# Altium schematic sheet TKeyboard.schDoc
size B; Organization: Altium Limited; Address1: L3, 12a Rodborough Rd; Address2: Frenchs Forest; Address3: NSW; Address4: Australia 2086; DocumentNumber: 1; SheetNumber: 1; SheetTotal: 1
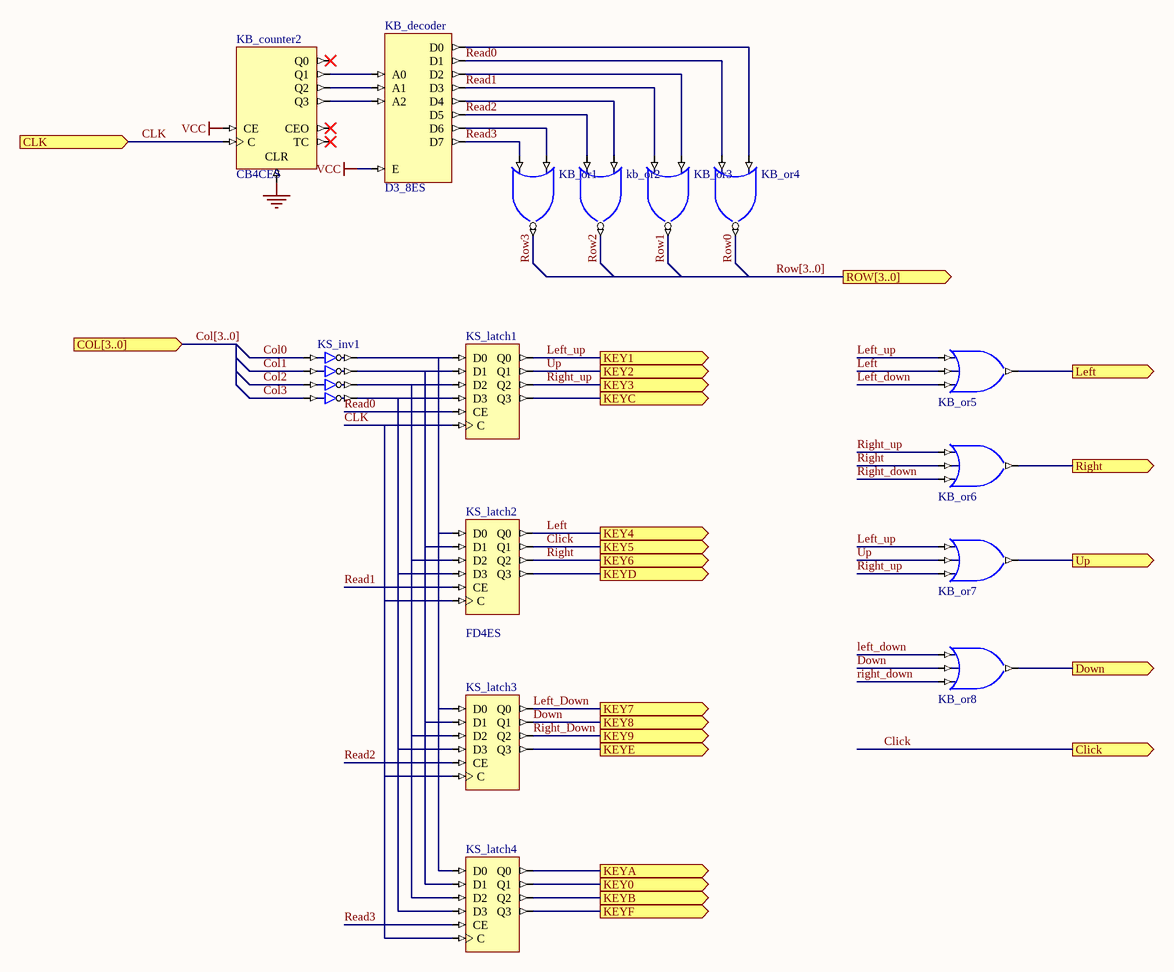
[diagram p0: TKeyboard.schDoc]

## Parts
KB_counter2  CB4CES
KB_decoder  D3_8ES
KB_or1  NOR2S  (value not drawn)
kb_or2  NOR2S  (value not drawn)
KB_or3  NOR2S  (value not drawn)
KB_or4  NOR2S  (value not drawn)
KB_or5  OR3S  (value not drawn)
KB_or6  OR3S  (value not drawn)
KB_or7  OR3S  (value not drawn)
KB_or8  OR3S  (value not drawn)
KS_inv1  INV4S  (value not drawn)
KS_latch1  FD4ES  (value not drawn)
KS_latch2  FD4ES
KS_latch3  FD4ES  (value not drawn)
KS_latch4  FD4ES  (value not drawn)

## Ports
Click (out), CLK (in), COL[3..0] (in), Down (out), KEY0 (out), KEY1 (out), KEY2 (out), KEY3 (out), KEY4 (out), KEY5 (out), KEY6 (out), KEY7 (out), KEY8 (out), KEY9 (out), KEYA (out), KEYB (out), KEYC (out), KEYD (out), KEYE (out), KEYF (out), Left (out), Right (out), ROW[3..0] (out), Up (out)

## Nets
GND: KB_counter2.CLR
VCC: KB_counter2.CE KB_decoder.E
Click: KS_latch2.Q1 ; port KEY5, port Click
CLK: KB_counter2.C KS_latch1.C KS_latch2.C KS_latch3.C KS_latch4.C ; port CLK
Col0: KS_inv1.I0
Col1: KS_inv1.I1
Col2: KS_inv1.I2
Col3: KS_inv1.I3
Down: KB_or8.I1 KS_latch3.Q1 ; port KEY8
Down: KB_or8.O ; port Down  [a separate net that carries the same name]
KEY0: KS_latch4.Q1 ; port KEY0
KEYA: KS_latch4.Q0 ; port KEYA
KEYB: KS_latch4.Q2 ; port KEYB
KEYC: KS_latch1.Q3 ; port KEYC
KEYD: KS_latch2.Q3 ; port KEYD
KEYE: KS_latch3.Q3 ; port KEYE
KEYF: KS_latch4.Q3 ; port KEYF
Left: KB_or5.I1 KS_latch2.Q0 ; port KEY4
Left: KB_or5.O ; port Left  [a separate net that carries the same name]
Left_Down: KB_or5.I2 KB_or8.I0 KS_latch3.Q0 ; port KEY7
Left_up: KB_or5.I0 KB_or7.I0 KS_latch1.Q0 ; port KEY1
Read0: KB_decoder.D1 KB_or4.I1 KS_latch1.CE
Read1: KB_decoder.D3 KB_or3.I1 KS_latch2.CE
Read2: KB_decoder.D5 kb_or2.I1 KS_latch3.CE
Read3: KB_decoder.D7 KB_or1.I1 KS_latch4.CE
Right: KB_or6.I1 KS_latch2.Q2 ; port KEY6
Right: KB_or6.O ; port Right  [a separate net that carries the same name]
Right_Down: KB_or6.I2 KB_or8.I2 KS_latch3.Q2 ; port KEY9
Right_up: KB_or6.I0 KB_or7.I2 KS_latch1.Q2 ; port KEY3
Row0: KB_or4.O
Row1: KB_or3.O
Row2: kb_or2.O
Row3: KB_or1.O
Up: KB_or7.I1 KS_latch1.Q1 ; port KEY2
Up: KB_or7.O ; port Up  [a separate net that carries the same name]
NetKB_counter2_Q1: KB_counter2.Q1 KB_decoder.A0
NetKB_counter2_Q2: KB_counter2.Q2 KB_decoder.A1
NetKB_counter2_Q3: KB_counter2.Q3 KB_decoder.A2
NetKB_decoder_D0: KB_decoder.D0 KB_or4.I0
NetKB_decoder_D2: KB_decoder.D2 KB_or3.I0
NetKB_decoder_D4: KB_decoder.D4 kb_or2.I0
NetKB_decoder_D6: KB_decoder.D6 KB_or1.I0
NetKS_inv1_O0: KS_inv1.O0 KS_latch1.D0 KS_latch2.D0 KS_latch3.D0 KS_latch4.D0
NetKS_inv1_O1: KS_inv1.O1 KS_latch1.D1 KS_latch2.D1 KS_latch3.D1 KS_latch4.D1
NetKS_inv1_O2: KS_inv1.O2 KS_latch1.D2 KS_latch2.D2 KS_latch3.D2 KS_latch4.D2
NetKS_inv1_O3: KS_inv1.O3 KS_latch1.D3 KS_latch2.D3 KS_latch3.D3 KS_latch4.D3

Not connected (* = marked no-connect by the designer): KB_counter2 CEO* Q0* TC*

## Buses and harness runs
bus Col[3..0] = port COL[3..0]
bus Row[3..0] = port ROW[3..0]

## Notes on the sheet
- Title
- Size:
- Date:
- B
- Number:
- Time:
- Revision:
- Sheet
- of
- File:

## Library data of the parts
KB_counter2 = CB4CES: 4-Bit Cascadable Binary Counters with Clock Enable and Asynchronous Clear, Single Pin Version; ArchiveName: GENERIC; Xilinx Equivalent: CB4CE; VHDLIB_SIM: GENERIC_LIB; Published: 28-Jan-2004; Publisher: Altium Limited; Core Revision: 1.00.00
KB_decoder = D3_8ES: Binary 3- to 8-Bit Decoder with Enable, Single Pin Version; Xilinx Equivalent: D3_8E; ArchiveName: GENERIC; VHDLIB_SIM: GENERIC_LIB; Published: 28-Jan-2004; Publisher: Altium Limited; Core Revision: 1.00.00
KB_or1 kb_or2 KB_or3 KB_or4 = NOR2S: 2-Input NOR Gate, Single Pin Version; Xilinx Equivalent: NOR2; ArchiveName: GENERIC; VHDLIB_SIM: GENERIC_LIB; Published: 28-Jan-2004; Publisher: Altium Limited; Core Revision: 1.00.00
KB_or5-KB_or8 = OR3S: 3-Input OR Gate, Single Pin Version; Xilinx Equivalent: OR3; ArchiveName: GENERIC; VHDLIB_SIM: GENERIC_LIB; Published: 28-Jan-2004; Publisher: Altium Limited; Core Revision: 1.00.00
KS_inv1 = INV4S: 4-Bit Inverter, Single Pin Version; Xilinx Equivalent: INV4; ArchiveName: GENERIC; VHDLIB_SIM: GENERIC_LIB; Published: 28-Jan-2004; Publisher: Altium Limited; Core Revision: 1.00.00
KS_latch1-KS_latch4 = FD4ES: 4-Bit D Flip-Flop with Clock Enable, Single Pin Version; ArchiveName: GENERIC; VHDLIB_SIM: GENERIC_LIB; Published: 28-Jan-2004; Publisher: Altium Limited; Core Revision: 1.00.00